# Altium project RF Front.PrjPcb
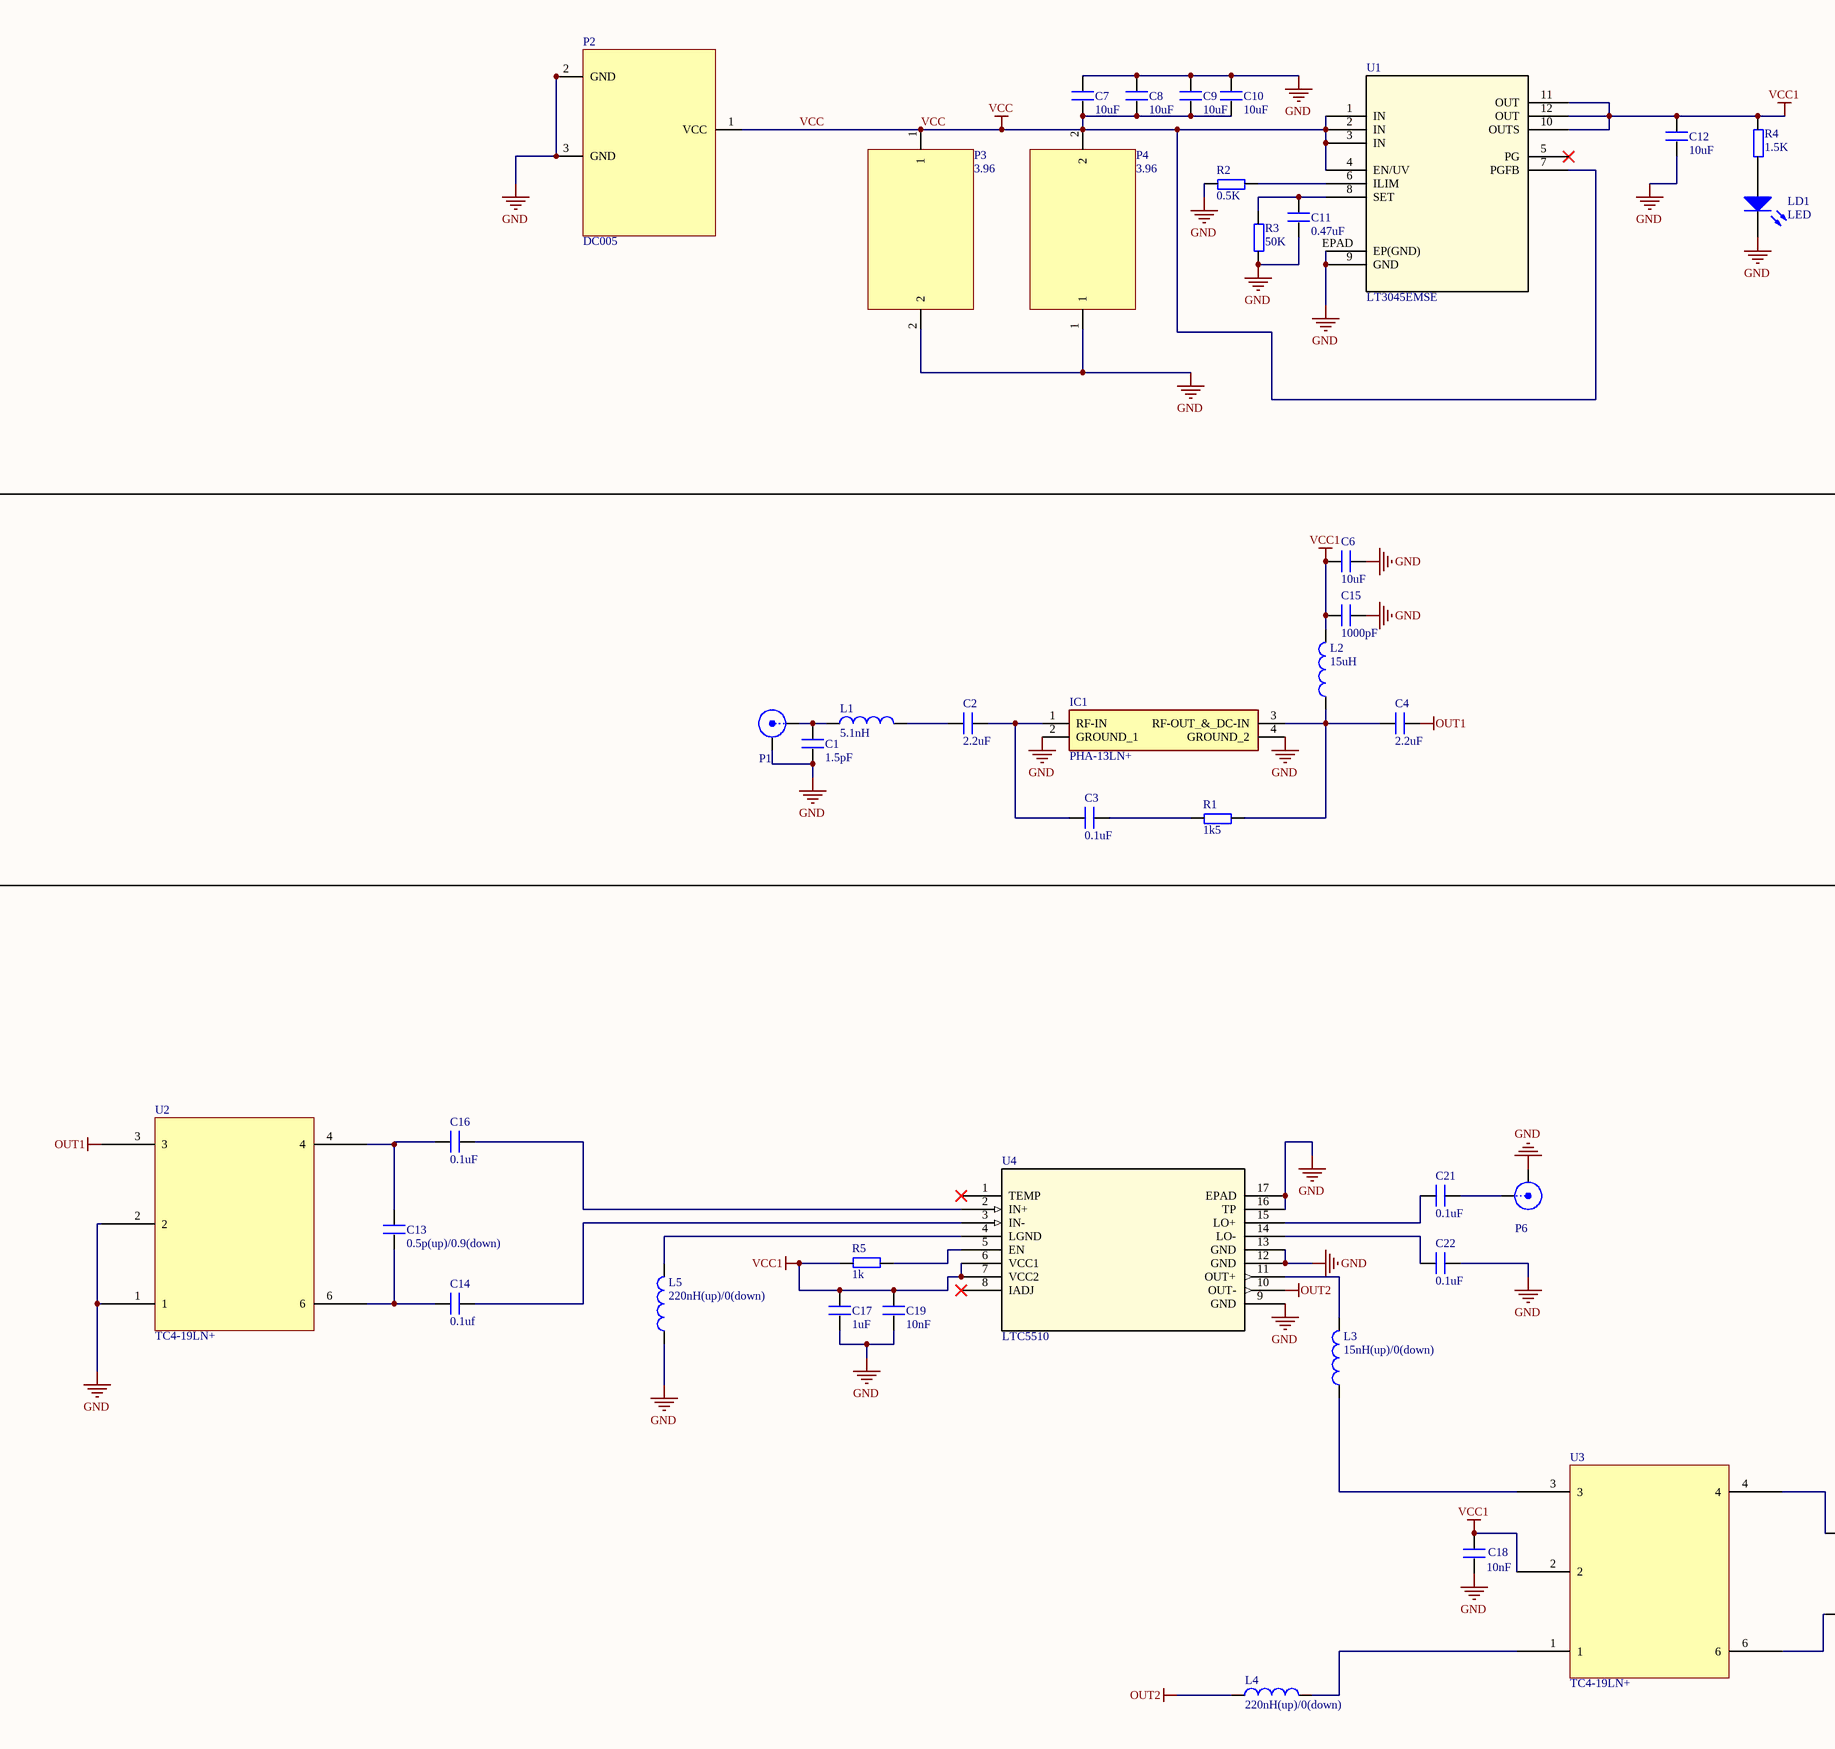
[diagram p0: RF Front.SchDoc, left]
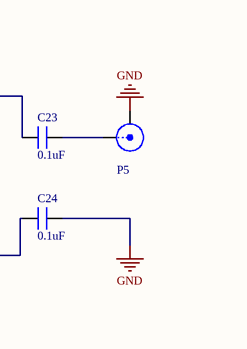
[diagram p1: RF Front.SchDoc, right]
1 sheet, 44 parts. Net scope: global (net labels, ports and power ports of the same name join across sheets).
Board file: RF Front.PcbDoc

## Sheet RF Front.SchDoc
size A2

### Parts
C1  1.5pF  [0402]
C2  2.2uF  [0402]
C3  0.1uF  [0402]
C4  2.2uF  [0402]
C6  10uF  [0603C]
C7  10uF  [CAP 1.5*4*8]
C8  10uF  [CAP 1.5*4*8]
C9  10uF  [0603C]
C10  10uF  [0603C]
C11  0.47uF  [0402]
C12  10uF  [0402]
C13  0.5p(up)/0.9(down)  [0402]
C14  0.1uf  [0402]
C15  1000pF  [0402]
C16  0.1uF  [0402]
C17  1uF  [0402]
C18  10nF  [0402]
C19  10nF  [0402]
C21  0.1uF  [0402]
C22  0.1uF  [0402]
C23  0.1uF  [0402]
C24  0.1uF  [0402]
IC1  PHA-13LN+  [PHA13LN]
L1  5.1nH  [0402]
L2  15uH  [1206C]
L3  15nH(up)/0(down)  [0603L]
L4  220nH(up)/0(down)  [0603L]
L5  220nH(up)/0(down)  [0603L]
LD1  LED  [SMDLED]
P1  SMA  [SMA]  (value not drawn)
P2  DC005  [DC10B]
P3  3.96  [3.96]
P4  3.96  [3.96]
P5  SMA  [SMA]  (value not drawn)
P6  SMA  [SMA]  (value not drawn)
R1  1k5  [0402]
R2  0.5K  [0402]
R3  50K  [0402]
R4  1.5K  [0603R]
R5  1k  [0603R]
U1  LT3045EMSE  [MSOP12-MSE-RevG_ADI]
U2  TC4-19LN+  [AT224]
U3  TC4-19LN+  [AT224]
U4  LTC5510  [QFN-16_UF]

### Nets
GND: C1.1 C6.1 C7.2 C8.2 C9.2 C10.2 C11.2 C12.1 C15.1 C17.2 C18.1 C19.2 C22.2 C24.2 IC1.2(GROUND_1) IC1.4(GROUND_2) L5.1 LD1.2(K) P1.2(Y) P2.2(GND) P2.3(GND) P3.2 P4.1 P5.2(Y) P6.2(Y) R2.1 R3.1 U1.9(GND) U1.EPAD(EP(GND)) U2.1 U2.2 U4.9(GND) U4.12(GND) U4.13(GND) U4.16(TP) U4.17(EPAD)
OUT1: C4.1 U2.3
OUT2: L4.1 U4.10(OUT-)
VCC: C7.1 C8.1 C9.1 C10.1 P2.1(VCC) P3.1 P4.2 U1.1(IN) U1.2(IN) U1.3(IN) U1.4(EN/UV) U1.7(PGFB)
VCC1: C6.2 C12.2 C15.2 C17.1 C18.2 C19.1 L2.2 R4.2 R5.2 U1.10(OUTS) U1.11(OUT) U1.12(OUT) U3.2 U4.6(VCC1) U4.7(VCC2)
NetC1_2: C1.2 L1.1 P1.1(X)
NetC2_1: C2.1 C3.2 IC1.1(RF-IN)
NetC2_2: C2.2 L1.2
NetC3_1: C3.1 R1.1
NetC4_2: C4.2 IC1.3(RF-OUT_&_DC-IN) L2.1 R1.2
NetC11_1: C11.1 R3.2 U1.8(SET)
NetC13_1: C13.1 C14.2 U2.6
NetC13_2: C13.2 C16.1 U2.4
NetC14_1: C14.1 U4.3(IN-)
NetC16_2: C16.2 U4.2(IN+)
NetC21_1: C21.1 P6.1(X)
NetC21_2: C21.2 U4.15(LO+)
NetC22_1: C22.1 U4.14(LO-)
NetC23_1: C23.1 U3.4
NetC23_2: C23.2 P5.1(X)
NetC24_1: C24.1 U3.6
NetL3_1: L3.1 U3.3
NetL3_2: L3.2 U4.11(OUT+)
NetL4_2: L4.2 U3.1
NetL5_2: L5.2 U4.4(LGND)
NetLD1_1: LD1.1(A) R4.1
NetR2_2: R2.2 U1.6(ILIM)
NetR5_1: R5.1 U4.5(EN)

Not connected (* = marked no-connect by the designer): U1 5(PG)*; U4 1(TEMP)* 8(IADJ)*

### Library data of the parts
C1-C4 C6-C19 C21-C24 = C: Capacitor
IC1 = PHA-13LN+: Integrated Circuit; Manufacturer_Name: Mini-Circuits; Datasheet Link: https://www.minicircuits.com/pdfs/PHA-13LN+.pdf; Height: 1.6mm; Manufacturer_Part_Number: PHA-13LN+; Mouser Part Number: 139-PHA-13LN; Mouser Price/Stock: https://www.mouser.co.uk/ProductDetail/Mini-Circuits/PHA-13LN%2b?qs=xZ%2FP%252Ba9zWqYkwnUBoTp7PQ%3D%3D
L1-L5 = Inductor: Value: 100uH; Published: 8-Jun-2000; Revision: July-2002: Re-released for DXP Platform.; Publisher: Altium Limited
LD1 = LED: Typical RED, GREEN, YELLOW, AMBER GaAs LED; Published: 8-Jun-2000; LatestRevisionDate: 17-Jul-2002; LatestRevisionNote: Re-released for DXP Platform.; PackageDocument: Feb-2002; PackageReference: 3.2X1.6X1.1; Publisher: Altium Limited
P1 P5 P6 = SMA: SMA Connector
R1-R5 = Resistor
U1 = LT3045EMSE: No Description Available; SourceLibrary: Analog_Devices_Inc_2020-09-15; Built_By: SunStream; Vendor: Analog Devices Inc; Copyright: Copyright (C) 2018 Accelerated Designs. All rights reserved; Manufacturer_Part_Number: LT3045EMSE; RefDes: RefDes; Type: DEV
U4 = LTC5510: 1MHz 至 6GHz、宽带、高线性度有源混频器; Manufacturer_Part_Number: LTC5510IUF#TRPBF; Vendor: Linear Technology; Built_By: EMA_UL_Team; Copyright: Copyright (C) 2018 Accelerated Designs. All rights reserved; RefDes: RefDes; Type: DEV; Value: Value